# EAGLE design ember_logic_v2 (EAGLE 5.11)
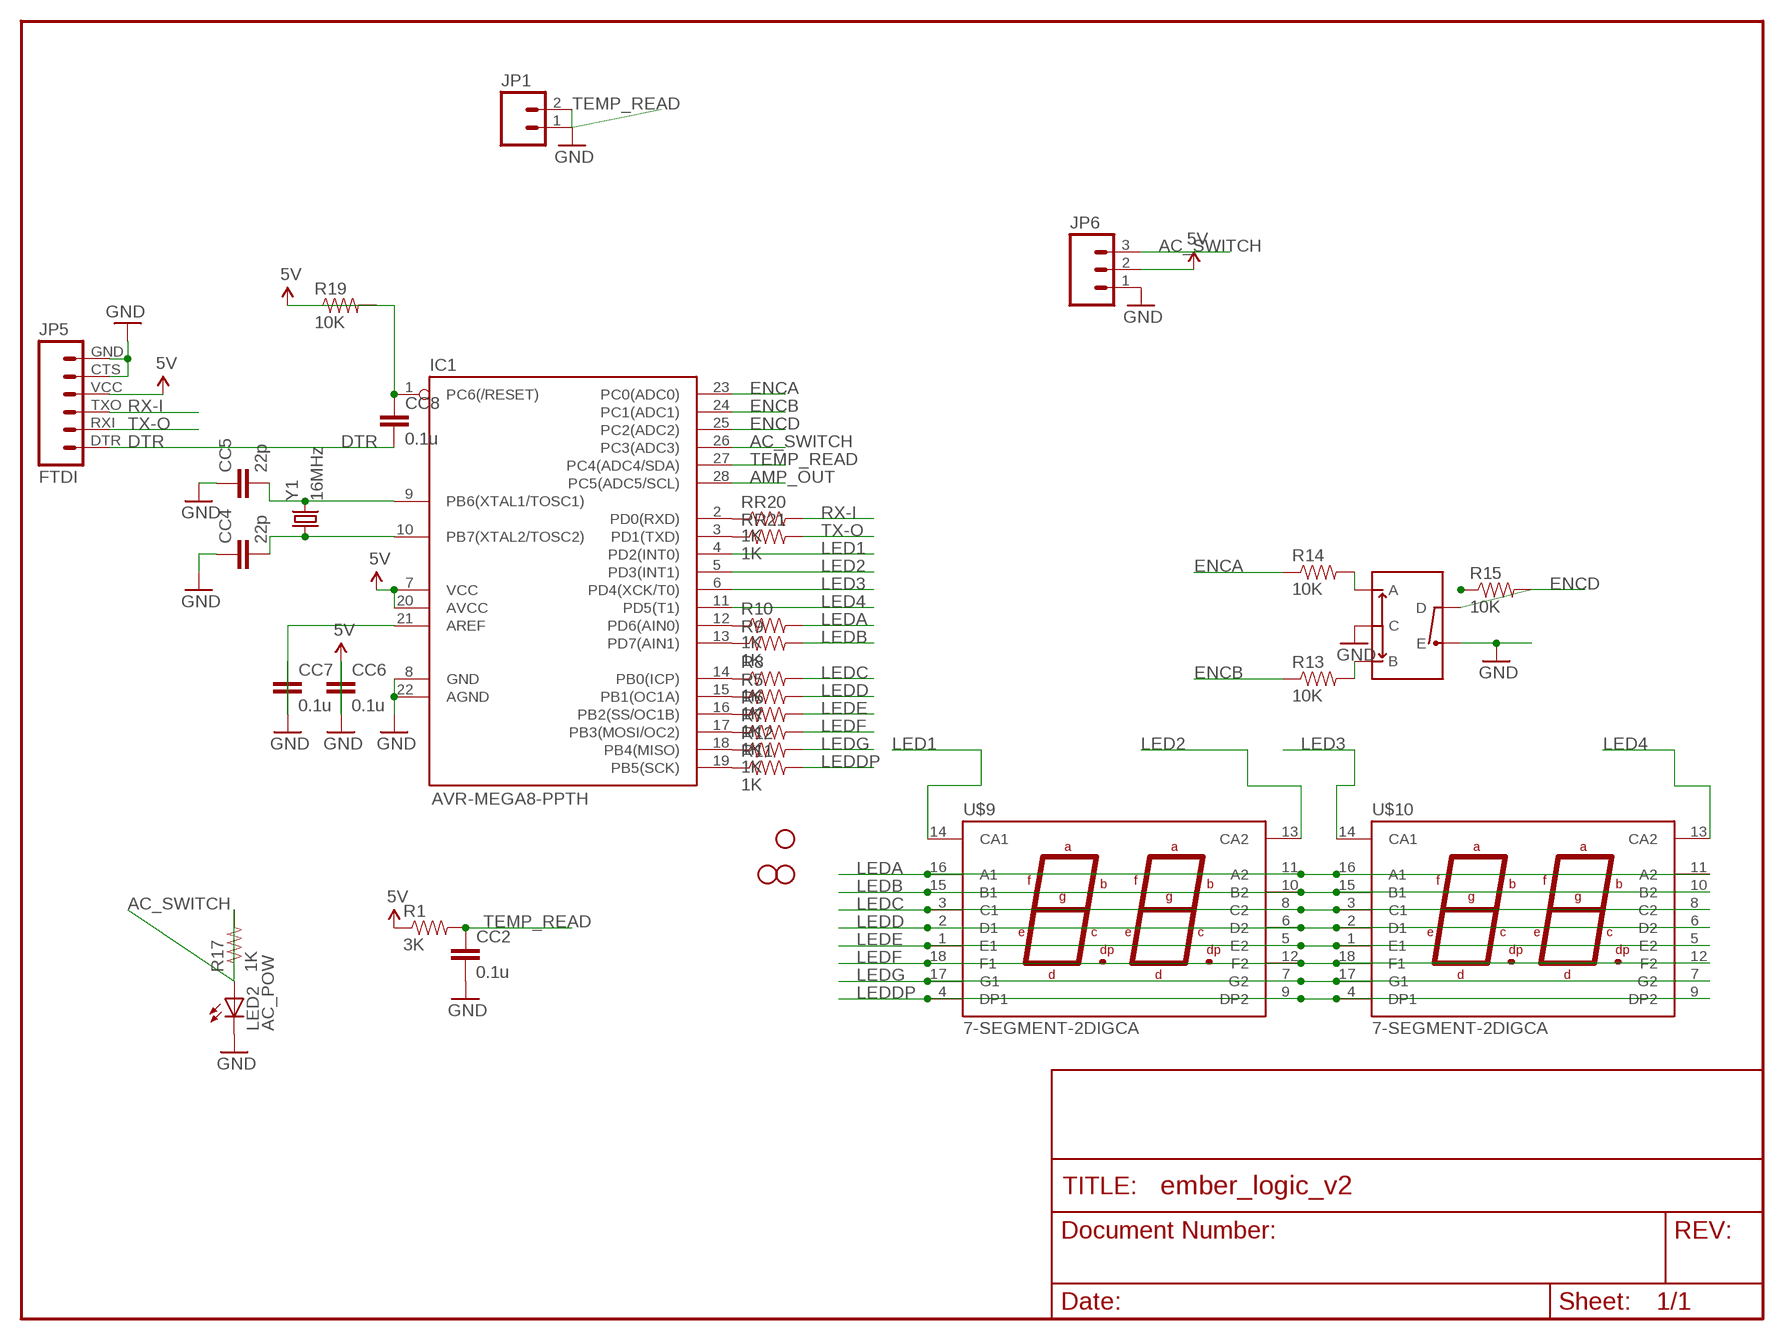
[diagram p0: schematic, sheet 1]

## Parts
CC2  0.1u  CAPPTH  [CAP-PTH-SMALL]
CC4  22p  CAPPTH  [CAP-PTH-SMALL]
CC5  22p  CAPPTH  [CAP-PTH-SMALL]
CC6  0.1u  CAPPTH  [CAP-PTH-SMALL]
CC7  0.1u  CAPPTH  [CAP-PTH-SMALL]
CC8  0.1u  CAPPTH  [CAP-PTH-SMALL]
IC1  AVR-MEGA8-PPTH  [DIL28-3]
JP1  M023.5MM_LOCK  [SCREWTERMINAL-3.5MM-2_LOCK]
JP2  STAND-OFF  [STAND-OFF]
JP3  STAND-OFF  [STAND-OFF]
JP5  FTDI  FTDI_BASICPTH  [FTDI_BASIC]
JP6  M03LOCK  [1X03_LOCK]
JP8  STAND-OFF  [STAND-OFF]
LED2  AC_POW  LED3MM  [LED3MM]
R1  3K  RESISTORPTH-1/4W  [AXIAL-0.4]
R5  1K  RESISTORPTH-1/4W  [AXIAL-0.4]
R6  1K  RESISTORPTH-1/4W  [AXIAL-0.4]
R7  1K  RESISTORPTH-1/4W  [AXIAL-0.4]
R8  1K  RESISTORPTH-1/4W  [AXIAL-0.4]
R9  1K  RESISTORPTH-1/4W  [AXIAL-0.4]
R10  1K  RESISTORPTH-1/4W  [AXIAL-0.4]
R11  1K  RESISTORPTH-1/4W  [AXIAL-0.4]
R12  1K  RESISTORPTH-1/4W  [AXIAL-0.4]
R13  10K  RESISTORPTH-1/4W  [AXIAL-0.4]
R14  10K  RESISTORPTH-1/4W  [AXIAL-0.4]
R15  10K  RESISTORPTH-1/4W  [AXIAL-0.4]
R17  1K  RESISTORPTH-1/4W  [AXIAL-0.4]
R19  10K  RESISTORPTH-1/4W  [AXIAL-0.4]
RR20  1K  RESISTORPTH-1/4W  [AXIAL-0.4]
RR21  1K  RESISTORPTH-1/4W  [AXIAL-0.4]
U$9  7-SEGMENT-2DIGCA  [7-SEGMENT-DISPLAY]
U$10  7-SEGMENT-2DIGCA  [7-SEGMENT-DISPLAY]
U$17  ENCODER  [ENCODER-BOURNES-PEC11]
Y1  16MHz  CRYSTALHC49UV  [HC49U-V]

## Nets
5V: CC6.2 IC1.7(VCC) IC1.20(AVCC) JP5.VCC JP6.2 R1.P$1 R19.P$2
AC_SWITCH: IC1.26(PC3(ADC3)) JP6.3 R17.P$1
AMP_OUT: IC1.28(PC5(ADC5/SCL))
DTR: CC8.2 JP5.DTR
ENCA: IC1.23(PC0(ADC0)) R14.P$1
ENCB: IC1.24(PC1(ADC1)) R13.P$1
ENCD: IC1.25(PC2(ADC2)) R15.P$1
GND: CC2.2 CC4.1 CC5.1 CC6.1 CC7.1 IC1.8(GND) IC1.22(AGND) JP1.2 JP5.CTS JP5.GND JP6.1 LED2.K(C) U$17.C U$17.E
LED1: IC1.4(PD2(INT0)) U$9.14(CA1)
LED2: IC1.5(PD3(INT1)) U$9.13(CA2)
LED3: IC1.6(PD4(XCK/T0)) U$10.14(CA1)
LED4: IC1.11(PD5(T1)) U$10.13(CA2)
LEDA: R10.P$2 U$9.11(A2) U$9.16(A1) U$10.11(A2) U$10.16(A1)
LEDB: R9.P$2 U$9.10(B2) U$9.15(B1) U$10.10(B2) U$10.15(B1)
LEDC: R8.P$2 U$9.3(C1) U$9.8(C2) U$10.3(C1) U$10.8(C2)
LEDD: R5.P$2 U$9.2(D1) U$9.6(D2) U$10.2(D1) U$10.6(D2)
LEDDP: R11.P$2 U$9.4(DP1) U$9.9(DP2) U$10.4(DP1) U$10.9(DP2)
LEDE: R6.P$2 U$9.1(E1) U$9.5(E2) U$10.1(E1) U$10.5(E2)
LEDF: R7.P$2 U$9.12(F2) U$9.18(F1) U$10.12(F2) U$10.18(F1)
LEDG: R12.P$2 U$9.7(G2) U$9.17(G1) U$10.7(G2) U$10.17(G1)
N$5: LED2.A R17.P$2
N$6: CC5.2 IC1.9(PB6(XTAL1/TOSC1)) Y1.2
N$7: CC4.2 IC1.10(PB7(XTAL2/TOSC2)) Y1.1
N$9: IC1.12(PD6(AIN0)) R10.P$1
N$10: IC1.13(PD7(AIN1)) R9.P$1
N$11: IC1.14(PB0(ICP)) R8.P$1
N$12: IC1.15(PB1(OC1A)) R5.P$1
N$13: IC1.2(PD0(RXD)) RR20.P$1
N$15: IC1.16(PB2(SS/OC1B)) R6.P$1
N$19: IC1.17(PB3(MOSI/OC2)) R7.P$1
N$20: CC7.2 IC1.21(AREF)
N$21: IC1.18(PB4(MISO)) R12.P$1
N$22: IC1.19(PB5(SCK)) R11.P$1
N$33: R14.P$2 U$17.A
N$34: R13.P$2 U$17.B
N$35: IC1.3(PD1(TXD)) RR21.P$1
N$36: R15.P$2 U$17.D
RESET: CC8.1 IC1.1(PC6(/RESET)) R19.P$1
RX-I: JP5.TXO RR20.P$2
TEMP_READ: CC2.1 IC1.27(PC4(ADC4/SDA)) JP1.1 R1.P$2
TX-O: JP5.RXI RR21.P$2

## Library data of the parts
CC2 CC4-CC8 = SparkFun:CAP: Capacitor Standard 0603 ceramic capacitor, and 0.1" leaded capacitor.
IC1 = SparkFun:AVR-MEGA8-P: MICROCONTROLLER 8 Kbytes FLASH 1 kbytes SRAM 512 bytes EEPROM USART 4-channel 10 bit ADC 2-channel 8 bit ADC
JP1 = SparkFun:M02: Header 2 Standard 2-pin 0.1" header. Use with straight break away headers (SKU : PRT-00116), right angle break away headers (PRT-00553), swiss pins (PRT-00743), machine pins (PRT-00117), and female headers (PRT-00115). Molex polarized connector foot print use with SKU : PRT-08233 with associated crimp pins and housings.
JP2 JP3 JP8 = SparkFun:STAND-OFF: Stand Off This is the mechanical footprint for a #4 phillips button head screw. Use the keepout ring to avoid running the screw head into surrounding components. SKU : PRT-00447
JP5 = SparkFun:FTDI_BASIC: FTDI Basic: 3.3V and 5V
JP6 = SparkFun:M03: Header 3 Standard 3-pin 0.1" header. Use with straight break away headers (SKU : PRT-00116), right angle break away headers (PRT-00553), swiss pins (PRT-00743), machine pins (PRT-00117), and female headers (PRT-00115). Molex polarized connector foot print use with SKU : PRT-08232 with associated crimp pins and housings.
LED2 = SparkFun:LED: LEDs Standard schematic elements and footprints for 5mm, 3mm, 1206, and 0603 sized LEDs. 5mm - Spark Fun Electronics SKU : COM-00529 (and others)
R1 R5-R15 R17 R19 RR20 RR21 = SparkFun:RESISTOR: Resistor Basic schematic elements and footprints for 0603, 1206, and PTH resistors.
U$9 U$10 = User:7-SEGMENT-2DIG
U$17 = User:ENCODER
Y1 = SparkFun:CRYSTAL: Crystals Various standard crystals. Proven footprints. Spark Fun Electronics SKU : COM-00534

## Net classes
1 10A/150: width 2.54 mm, clearance 1.854 mm
2 1A/150: width 0.102 mm, clearance 1.854 mm

## Board
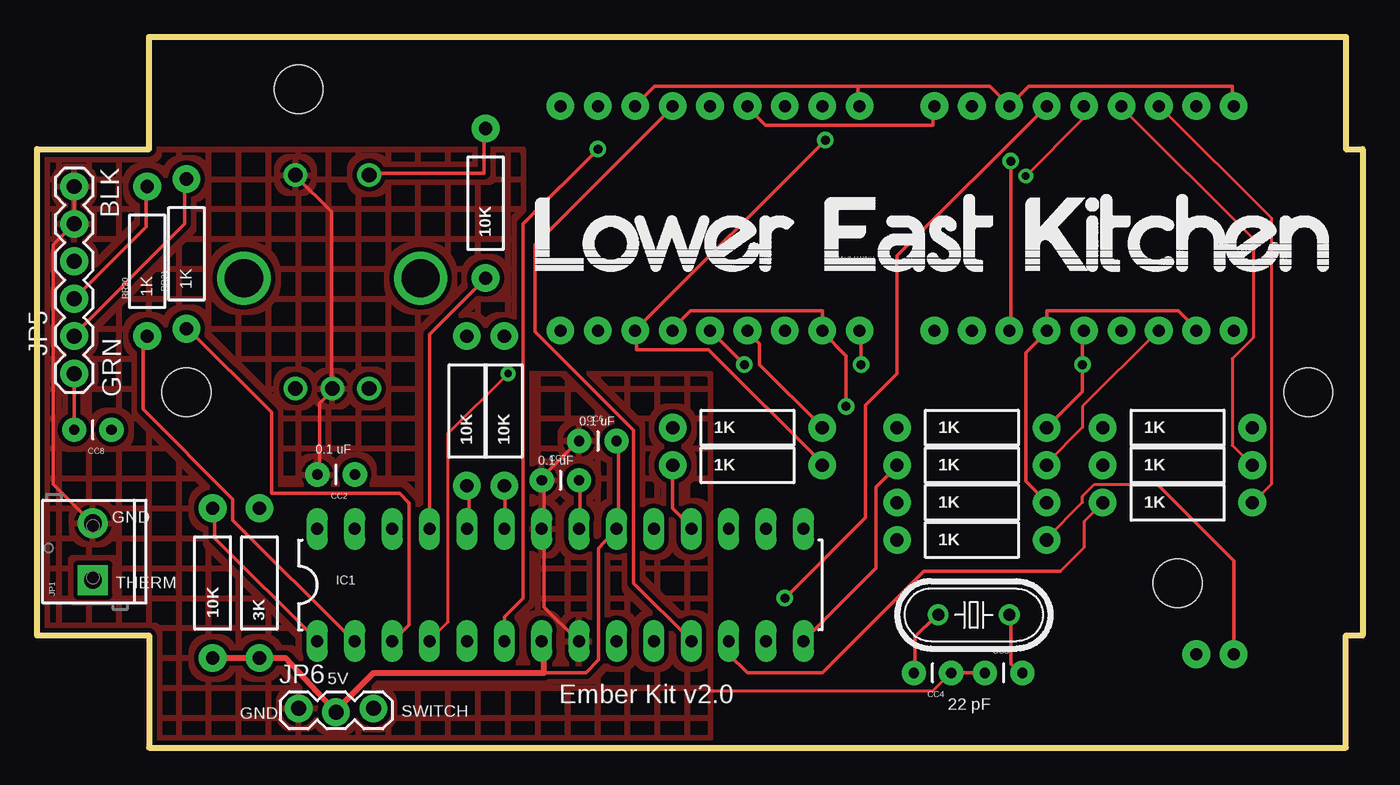
[diagram p1: board, top side]
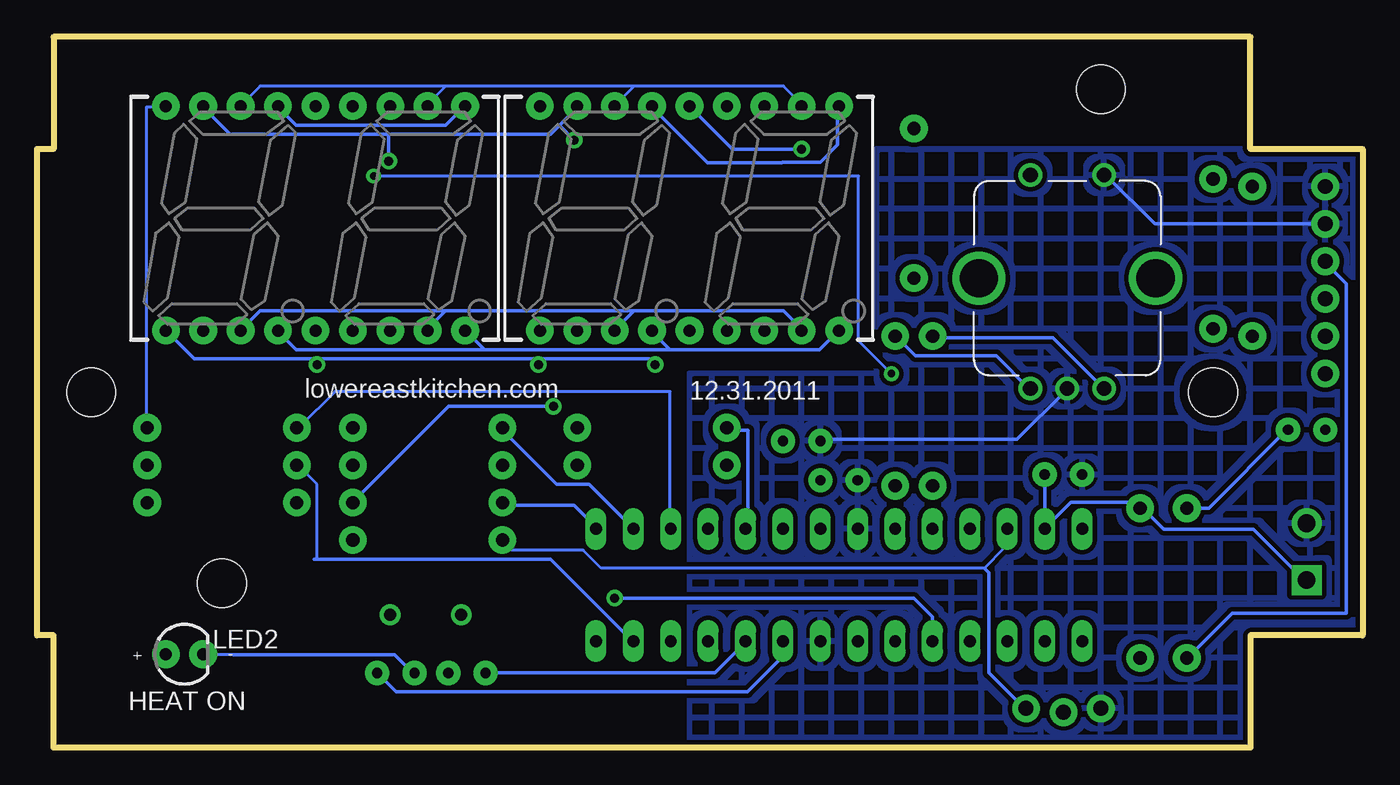
[diagram p2: board, bottom side, seen from below]

Size 90.04 x 48.26 mm. Coordinates in mm from the lower left corner, seen from the top.
Outline: 0,7.62 7.62,7.62 7.62,0 88.9,0 88.9,7.62 90.04,7.62 90.04,40.64 88.9,40.64 88.9,48.26 7.62,48.26 7.62,40.64 0,40.64 0,7.62
Copper layers (1*16): Top 0.035mm / dielectric 1.5mm / Bottom 0.035mm
Design rules "SparkFun": minimum track width 8mil, minimum drill 20mil, track to track 8mil, track to pad 8mil, pad to pad 8mil, via to via 8mil, smd to smd 8mil, copper to edge 10mil, drill to drill 8mil, minimum pad ring 12mil, minimum via ring 10mil, stop-mask expansion 4mil, vias tented up to drill 25mil, thermal gap 10mil

### Footprints (pad centres in the part's own frame; a part is rotated, then mirrored left to right if it is on the bottom)
CAP-PTH-SMALL = drill 0.7 pad 1.651 round: 1 0,0; 2 2.54,0
DIL28-3 = drill 0.813 long: 1 -16.51,-3.81; 2 -13.97,-3.81; 3 -11.43,-3.81; 4 -8.89,-3.81; 5 -6.35,-3.81; 6 -3.81,-3.81; 7 -1.27,-3.81; 8 1.27,-3.81; 9 3.81,-3.81; 10 6.35,-3.81; 11 8.89,-3.81; 12 11.43,-3.81; 13 13.97,-3.81; 14 16.51,-3.81; 15 16.51,3.81; 16 13.97,3.81; 17 11.43,3.81; 18 8.89,3.81; 19 6.35,3.81; 20 3.81,3.81; 21 1.27,3.81; 22 -1.27,3.81; 23 -3.81,3.81; 24 -6.35,3.81; 25 -8.89,3.81; 26 -11.43,3.81; 27 -13.97,3.81; 28 -16.51,3.81
SCREWTERMINAL-3.5MM-2_LOCK = drill 1.2 pad 2.032 square: 1 -0.178,0 | drill 1.2 pad 2.032 round: 2 3.678,0
STAND-OFF = hole 3.302: 0,0
FTDI_BASIC = drill 1.016 pad 1.88 round: CTS 10.16,0; DTR 0,0; GND 12.7,0; RXI 2.54,0; TXO 5.08,0; VCC 7.62,0
1X03_LOCK = drill 1.016 pad 1.88 round: 1 0,0.127; 2 2.54,-0.127; 3 5.08,0.127
LED3MM = drill 0.813 pad 1.88 round: A -1.27,0; K 1.27,0
AXIAL-0.4 = drill 0.9 pad 1.88 round: P$1 -5.08,0; P$2 5.08,0
7-SEGMENT-DISPLAY = drill 0.813 pad 1.88 round: 1 -10.16,-7.62; 2 -7.62,-7.62; 3 -5.08,-7.62; 4 -2.54,-7.62; 5 0,-7.62; 6 2.54,-7.62; 7 5.08,-7.62; 8 7.62,-7.62; 9 10.16,-7.62; 10 10.16,7.62; 11 7.62,7.62; 12 5.08,7.62; 13 2.54,7.62; 14 0,7.62; 15 -2.54,7.62; 16 -5.08,7.62; 17 -7.62,7.62; 18 -10.16,7.62
ENCODER-BOURNES-PEC11 = drill 1 round: A -2.5,-7.5; B 2.5,-7.5; C 0,-7.5; D -2.5,7; E 2.5,7 | drill 2.6 round: P$1 6,0; P$2 -6,0
HC49U-V = drill 0.813 round: 1 -2.413,0; 2 2.413,0

### Placement (x,y rotation side)
CC2  21.59,18.54 180 top
CC4  62.1,5.08 180 top
CC5  64.39,5.08 0 top
CC6  36.83,20.83 0 top
CC7  34.29,18.16 0 top
CC8  5.08,21.59 180 top
IC1  35.56,11.05 0 top
JP1  3.81,11.56 90 top
JP2  17.78,44.7 0 top
JP3  77.47,11.18 0 top
JP5  2.54,25.4 90 top
JP6  17.78,2.54 0 top
JP8  10.16,24.13 0 top
JP9  STAND-OFF  [STAND-OFF]  86.36,24.13 0 top
LED2  80.01,6.35 0 bottom
R1  15.11,11.18 90 top
R5  63.5,16.64 0 top
R6  63.5,21.72 0 top
R7  77.47,21.72 0 top
R8  63.5,19.18 0 top
R9  77.47,19.18 0 top
R10  77.47,16.64 0 top
R11  48.26,21.72 0 top
R12  48.26,19.18 0 top
R13  29.21,22.86 90 top
R14  31.75,22.86 90 top
R15  30.48,36.96 90 top
R17  63.5,14.1 0 top
R19  11.94,11.18 270 top
RR20  7.49,33.02 90 top
RR21  10.16,33.53 90 top
U$9  71.12,35.94 0 bottom
U$10  45.72,35.94 0 bottom
U$17  20.07,31.88 0 bottom
Y1  63.63,9.02 0 top

### Tracks (layer width: path | path; a pad name or v marks a point on that pad's centre or on a via)
5V
  Top 0.254: CC6.2 39.52,20.73 39.52,15.04 IC1.20 39.32,14.83 38.15,13.54 38.15,5.97 37.29,5.11 34.44,5.11 | 34.44,7.11 IC1.7
  Top 0.406: 34.44,7.11 34.44,5.11 34.42,5.08 22.86,5.08 20.32,2.54 JP6.2 16.89,6.1 R1.P$1 R19.P$2
  Bottom 0.254: JP5.VCC 2.54,32.92 1.12,31.5 1.12,9.14 8.84,9.14 11.89,6.1 R19.P$2
AC_SWITCH
  Bottom 0.203: R17.P$1 58.42,14.02 57.81,13.41 52.93,13.41 51.71,12.19 25.71,12.19 24.28,13.61 24.28,14.83 IC1.26
  Bottom 0.254: 22.99,2.67 25.4,5.08 25.4,11.89 25.71,12.19
  Bottom 0.61: JP6.3 22.99,2.67
DTR
  Top 0.254: CC8.2 JP5.DTR
ENCA
  Top 0.254: IC1.23 31.8,15.04 31.8,17.68 R14.P$1
ENCB
  Top 0.254: IC1.24 29.36,15.04 29.36,17.68 R13.P$1
ENCD
  Top 0.254: IC1.25 26.67,28.07 R15.P$1
GND
  Top 0.203: CC4.1 62.08,5.08 60.86,3.86 45.72,3.86
  Top 0.254: CC2.2 19.2,18.69 19.2,23.37 20.02,24.18 U$17.C 20.02,24.38 20.02,36.37 17.58,38.81 U$17.E | JP5.GND JP5.CTS 1.12,34.14 1.12,17.88 3.76,15.24 JP1.2 | CC4.1 CC5.1 | IC1.8 36.68,7.32 34.44,9.55 34.44,14.83 IC1.22 34.44,15.04 34.44,18.09 CC7.1 34.44,18.29 34.44,18.49 36.68,20.73 CC6.1
  Bottom 0.254: JP5.CTS 14.12,35.56 17.37,38.81 U$17.E | LED2.K 76.71,6.33 76.3,6.3 65.73,6.3 64.52,5.08 CC5.1 | U$17.C 20.22,24.18 23.47,20.93 36.68,20.93 CC6.1
  pour Bottom (isolate 0.305, hatched): 0,40.64 33.02,40.64 33.02,25.4 45.72,25.4 45.72,0 7.62,0 7.62,7.62 0,7.62
  pour Top (isolate 0.305, hatched): 0,40.64 33.02,40.64 33.02,25.4 45.72,25.4 45.72,0 7.62,0 7.62,7.62 0,7.62
LED1  (via drill 0.51)
  Top 0.203: v32,25.4 27.94,21.34 27.94,8.53 26.72,7.32 IC1.4 | v67.16,38.81 71.02,42.67 71.02,43.48 U$9.14
  Bottom 0.203: v32,25.4 34.24,27.64 34.24,38.81 v67.16,38.81
LED2  (via drill 0.61)
  Top 0.254: v50.8,10.16 56.26,15.62 56.26,23.24 58.42,25.4 58.42,33.4 U$9.13
  Bottom 0.254: IC1.5 29.21,8.89 30.48,10.16 v50.8,10.16
LED3  (via drill 0.61)
  Top 0.254: IC1.6 31.75,8.89 33.02,10.16 33.02,35.56 v38.1,40.64
  Bottom 0.254: v38.1,40.64 42.8,40.64 U$10.14
LED4
  Top 0.254: IC1.11 44.4,7.32 40.54,11.18 40.54,21.54 33.83,28.25 33.83,34.14 43.18,43.48 U$10.13
LEDA
  Top 0.203: R10.P$2 82.6,16.66 83.82,17.88 83.82,35.97 76.3,43.48 U$9.16
  Bottom 0.203: 49.48,44.91 39.32,44.91 38.1,43.69 U$10.11 | 49.48,44.91 50.7,43.69 U$10.16 | 62.28,44.91 63.5,43.69 U$9.11 | 49.48,44.91 62.28,44.91 | 62.28,44.91 74.88,44.91 76.1,43.69 U$9.16
LEDB
  Top 0.203: R9.P$2 82.4,19.3 81.18,20.52 81.18,26.42 82.6,27.84 82.6,34.54 73.66,43.48 U$9.15
  Top 0.254: U$10.15 48.26,43.48 49.48,42.27 60.86,42.27 60.86,43.48 U$9.10
  Bottom 0.254: U$10.10 35.66,43.48 35.66,40.92 36.83,39.75 39.4,39.75 39.42,39.73 44.5,39.73 48.26,43.48 U$10.15 | U$9.10 61.06,43.48 62.28,42.27 72.44,42.27 73.66,43.48 U$9.15
LEDC
  Top 0.203: R8.P$2 68.58,19.3 71.02,21.74 71.02,23.16 76.1,28.25 U$9.3
  Bottom 0.254: 49.48,29.67 39.32,29.67 38.1,28.45 U$10.8 | 49.48,29.67 50.7,28.45 U$10.3 | 62.28,29.67 63.5,28.45 U$9.8 | 49.48,29.67 62.28,29.67 | 62.28,29.67 74.88,29.67 76.1,28.45 U$9.3
LEDD  (via drill 0.61)
  Top 0.254: U$10.6 43.18,28.45 44.4,29.67 53.34,29.67 U$10.2 53.34,28.25 54.97,26.62 v54.97,23.16 | R5.P$2 68.58,16.66 67.16,18.09 67.16,26.82 68.58,28.25 U$9.6 68.58,29.67 77.52,29.67 78.74,28.45 U$9.2
  Bottom 0.254: v54.97,23.16 62.08,23.16 68.58,16.66 R5.P$2
LEDDP
  Top 0.254: R11.P$2 53.34,21.74 49.07,26.01 49.07,27.43 48.26,28.25 U$10.4
  Bottom 0.254: 47.04,27.03 36.88,27.03 35.66,28.25 U$10.9 | 47.04,27.03 48.26,28.25 U$10.4 | 59.64,27.03 60.86,28.25 U$9.9 | 47.04,27.03 59.64,27.03 | 59.64,27.03 72.44,27.03 73.66,28.25 U$9.4
LEDE  (via drill 0.61)
  Top 0.254: R6.P$2 68.58,21.74 71.02,24.18 v71.02,26.01 71.02,28.25 U$9.5 | v48.06,26.01 45.82,28.25 U$10.5 | v55.98,26.01 55.98,28.25 U$10.1
  Bottom 0.254: v48.06,26.01 48.46,26.42 55.98,26.42 | 71.02,26.42 79.35,26.42 81.18,28.25 U$9.1 | 55.98,26.42 71.02,26.42 | 55.98,26.42 v55.98,26.01 | 71.02,26.42 v71.02,26.01
LEDF
  Top 0.254: 55.78,44.91 41.96,44.91 40.74,43.69 U$10.12 | 55.78,44.91 55.78,43.69 U$10.18 | 55.78,44.91 64.72,44.91 65.94,43.69 U$9.12 66.14,43.69 67.36,44.91 81.18,44.91 81.18,43.69 U$9.18
  Bottom 0.203: R7.P$2 82.6,21.74 82.6,43.48 81.38,43.48 U$9.18
LEDG  (via drill 0.61)
  Top 0.254: R12.P$2 53.34,19.3 45.62,27.03 40.74,27.03 40.74,28.25 U$10.7 40.74,28.45 v53.54,41.25 | v66.14,39.83 66.14,28.45 U$9.7
  Bottom 0.254: 54.56,42.27 55.17,41.66 66.14,41.66 | 54.56,42.27 53.34,43.48 U$10.17 | 66.14,41.66 76.91,41.66 78.74,43.48 U$9.17 | 66.14,41.66 v66.14,39.83 | v53.54,41.25 54.56,42.27
N$5
  Top 0.203: R17.P$2 68.58,14.22 71.02,16.66 71.02,17.07 71.83,17.88 76.1,17.88
  Top 0.254: 76.1,17.88 81.28,12.7 LED2.A
N$6
  Top 0.254: CC5.2 66.75,5.08 66.14,5.69 66.14,8.94 Y1.2
  Bottom 0.254: IC1.9 39.37,6.22 41.78,3.81 65.66,3.81 CC5.2
N$7
  Top 0.254: Y1.1 61.06,8.94 59.64,7.52 59.64,5.08 CC4.2
  Bottom 0.254: IC1.10 41.96,7.11 43.99,5.08 CC4.2
N$9
  Top 0.203: 69.52,11.99 71.14,13.61 71.14,15.37 72.24,16.46 R10.P$1
  Top 0.254: IC1.12 46.99,6.35 48.26,5.08 53.34,5.08 60.25,11.99 69.52,11.99
N$10
  Bottom 0.203: 71.02,12.8 71.02,17.88 72.24,19.1 R9.P$1
  Bottom 0.254: 71.22,12.8 71.02,12.8 55.17,12.8 49.68,7.32 IC1.13
N$11
  Top 0.254: IC1.14 52.12,7.32 57,12.19 57,17.68 58.42,19.1 R8.P$1
N$12
  Bottom 0.254: IC1.15 52.12,15.04 53.54,16.46 58.42,16.46 R5.P$1
N$13
  Top 0.254: IC1.2 21.44,7.32 13.31,15.44 13.31,16.87 7.21,22.96 7.21,27.64 7.42,27.84 RR20.P$1
N$15
  Bottom 0.254: IC1.16 49.68,15.04 52.53,17.88 54.76,17.88 58.42,21.54 R6.P$1
N$19
  Bottom 0.203: IC1.17 47.04,15.04 47.04,24.18 69.8,24.18 72.24,21.74 R7.P$1
N$20
  Top 0.254: IC1.21 36.88,15.04 36.88,18.09 CC7.2
N$21
  Top 0.254: IC1.18 44.4,15.04 43.18,16.26 R12.P$1
N$22
  Bottom 0.254: IC1.19 41.76,15.04 41.76,21.54 43.18,21.54 R11.P$1
N$33
  Bottom 0.254: U$17.A 22.66,24.38 24.89,26.62 30.38,26.62 31.6,27.84 R14.P$2
N$34
  Bottom 0.254: U$17.B 21.03,27.84 29.16,27.84 R13.P$2
N$35
  Top 0.254: IC1.3 24.28,7.32 25.3,8.33 25.3,16.61 24.64,17.27 15.95,17.27 15.95,22.76 10.26,28.45 RR21.P$1
N$36
  Top 0.254: U$17.D 22.66,39.01 30.38,39.01 30.38,41.86 R15.P$2
RESET
  Top 0.254: IC1.1 19,7.32 12.09,14.22 12.09,16.26 R19.P$1
  Bottom 0.254: CC8.1 5.18,21.54 10.46,16.26 R19.P$1
RX-I
  Top 0.254: JP5.TXO 7.42,35.36 7.42,38 RR20.P$2
TEMP_READ
  Bottom 0.254: JP1.1 3.96,11.38 7.42,14.83 13.51,14.83 14.94,16.26 R1.P$2 15.14,16.26 15.55,16.66 19.81,16.66 21.44,15.04 IC1.27 CC2.1
TX-O
  Top 0.254: JP5.RXI 2.54,28.04 10.06,35.56 10.06,38.61 RR21.P$2

### Text on the board
tPlace: BLK | 1K | 1K | GRN | 0.1 uF | 0.1 uF | 0.1 uF | GND | THERM | 5V | Ember Kit v2.0 | 22 pF | GND | SWITCH
bPlace: 12.31.2011 | lowereastkitchen.com | - | + | HEAT ON